# Altium schematic sheet Perfboard_Connection.SchDoc
size A4; SheetNumber: 1; SheetTotal: 1
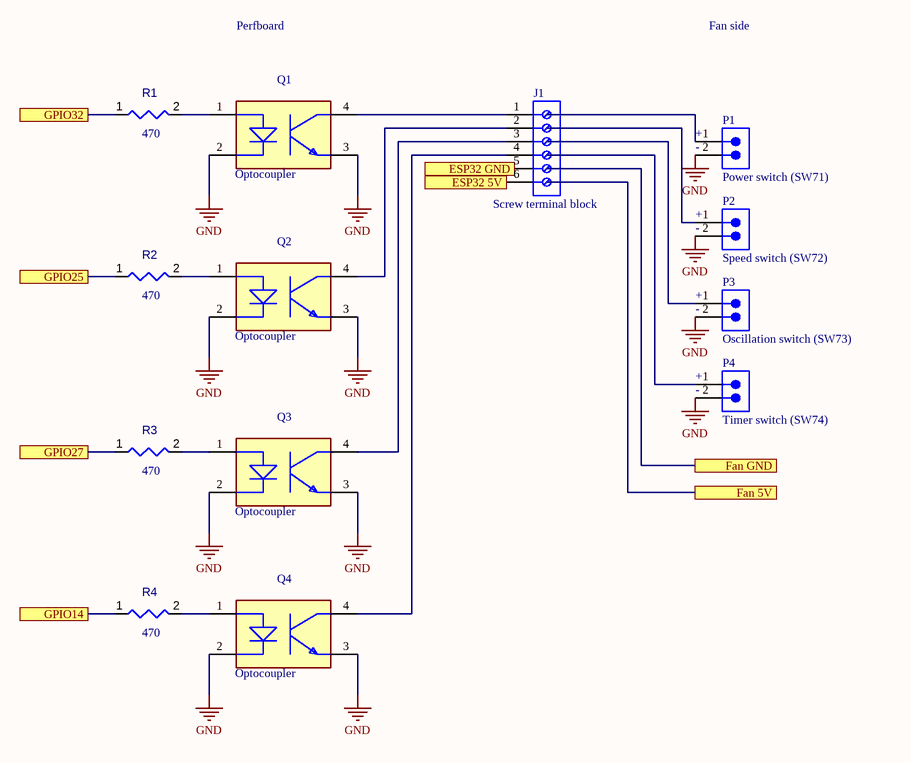
[diagram p0: Perfboard_Connection.SchDoc]

## Parts
J1  Screw terminal block  [691132700006]
P1  Power switch (SW71)  [691701500002B]
P2  Speed switch (SW72)  [691701500002B]
P3  Oscillation switch (SW73)  [691701500002B]
P4  Timer switch (SW74)  [691701500002B]
Q1  Optocoupler  [FP-PC817X1J000F-MFG]
Q2  Optocoupler  [FP-PC817X1J000F-MFG]
Q3  Optocoupler  [FP-PC817X1J000F-MFG]
Q4  Optocoupler  [FP-PC817X1J000F-MFG]
R1  value 470  [RESC0805(2012)_L]  (hidden comment: Resistor 470R +/-5% 0805 125 mW)
R2  value 470  [RESC0805(2012)_L]  (hidden comment: Resistor 470R +/-5% 0805 125 mW)
R3  value 470  [RESC0805(2012)_L]  (hidden comment: Resistor 470R +/-5% 0805 125 mW)
R4  value 470  [RESC0805(2012)_L]  (hidden comment: Resistor 470R +/-5% 0805 125 mW)

## Ports
ESP32 5V, ESP32 GND, Fan 5V, Fan GND, GPIO14, GPIO25, GPIO27, GPIO32

## Nets
GND: P1.2 P2.2 P3.2 P4.2 Q1.2(C) Q1.3(E) Q2.2(C) Q2.3(E) Q3.2(C) Q3.3(E) Q4.2(C) Q4.3(E)
ESP32 5V: J1.6 ; port ESP32 5V
GPIO14: R4.1 ; port GPIO14
GPIO25: R2.1 ; port GPIO25
GPIO27: R3.1 ; port GPIO27
GPIO32: R1.1 ; port GPIO32
NetJ1_1: J1.1 Q1.4(C)
NetJ1_2: J1.2 Q2.4(C)
NetJ1_3: J1.3 Q3.4(C)
NetJ1_4: J1.4 Q4.4(C)
NetQ1_1: Q1.1(A) R1.2
NetQ2_1: Q2.1(A) R2.2
NetQ3_1: Q3.1(A) R3.2
NetQ4_1: Q4.1(A) R4.2

Not connected (* = marked no-connect by the designer): J1 5; P1 1; P2 1; P3 1; P4 1

## Notes on the sheet
- Perfboard
- Fan side
- (near P1) +
- (near P1) -
- (near P2) +
- (near P2) -
- (near P3) +
- (near P3) -
- (near P4) +
- (near P4) -

## Library data of the parts
J1 = CMP-1502-03286-3: Terminal Block, 5MM Pitch, Vertical, Pressure Clamp, 30-12 AWG, 6 Pins, Gry; Voltage: 300V; Wire Gauge (Min): 12AWG; Pitch: 5.0038mm; Wire Gauge (Max): 24AWG; Plating: Steel; Number of Levels: 1; Current: 16A; Number of Positions Per Level: 6; Color: Grey; Termination: Screw; Number of Pins: 6; RoHS: Compliant; Contact Plating: Tin; Lead Pitch: 5mm; Mount: Through Hole; Min Operating Temperature: -30°C; Housing Material: PC; Max Operating Temperature: 130°C; Packaging: Box
P1-P4 = CMP-1502-02318-3: Terminal Block, 5.08MM, Open Vertical Pcb Header, Thr Type, 2 Pins; Gender: Male; Number of Contacts: 2; Current Rating: 10A; Voltage Rating: 300V; Mount: Through Hole; Max Operating Temperature: 105°C; Contact Gender: Male; REACH SVHC: Unknown; Color: Black; Number of Pins: 2; RoHS: Compliant; Contact Material: Brass; Length: 9.76mm; Min Operating Temperature: -40°C; Housing Material: Polymer; Pitch: 5.08mm; Connector Type: Terminal Block; Contact Plating: Tin; Lead Pitch: 5.08mm; Termination: PCB
Q1-Q4 = CMP-65434-000003-1: OPTOISOLATOR 5KV TRANS 4DIP; Collector Emitter Saturation Voltage: 200mV; Forward Voltage: 1.4V; Power Dissipation: 200mW; Input Current: 20mA; Max Collector Current: 50mA; Collector Emitter Breakdown Voltage: 80V; Rise Time: 18000ns; Number of Elements: 1; Reverse Breakdown Voltage: 6V; Current Transfer Ratio: 600%; Min Operating Temperature: -30°C; Number of Pins: 4; Radiation Hardening: No; Output Current per Channel: 50mA; Case/Package: DIP; Fall Time: 18000ns; Forward Current: 50mA; Isolation Voltage: 5kV; Package Quantity: 2000; Max Operating Temperature: 100°C; Packaging: Sleeve; Max Input Current: 50mA; Output Voltage: 80V; Max Power Dissipation: 200mW; Mount: Through Hole; Number of Channels: 1; Collector Emitter Voltage (VCEO): 80V
R1-R4 = CMP-009-00122-3: Chip Resistor, 470 Ohms, +/-5%, 125 mW, -55 to 155 degC, 0805; Tolerance: 5%; Power: 125mW; Max Operating Temperature: 155°C; Case/Package: 0805; Pins: 2; Min Operating Temperature: -55°C